# EasyEDA schematic SCH_Rover-Scheme1_2026-06-01.json
TITLE: Sheet_1; REV: 1.0; Date: 2026-05-30; Sheet: 1/1; Drawn By: jimmysiska6; Company: Your Company
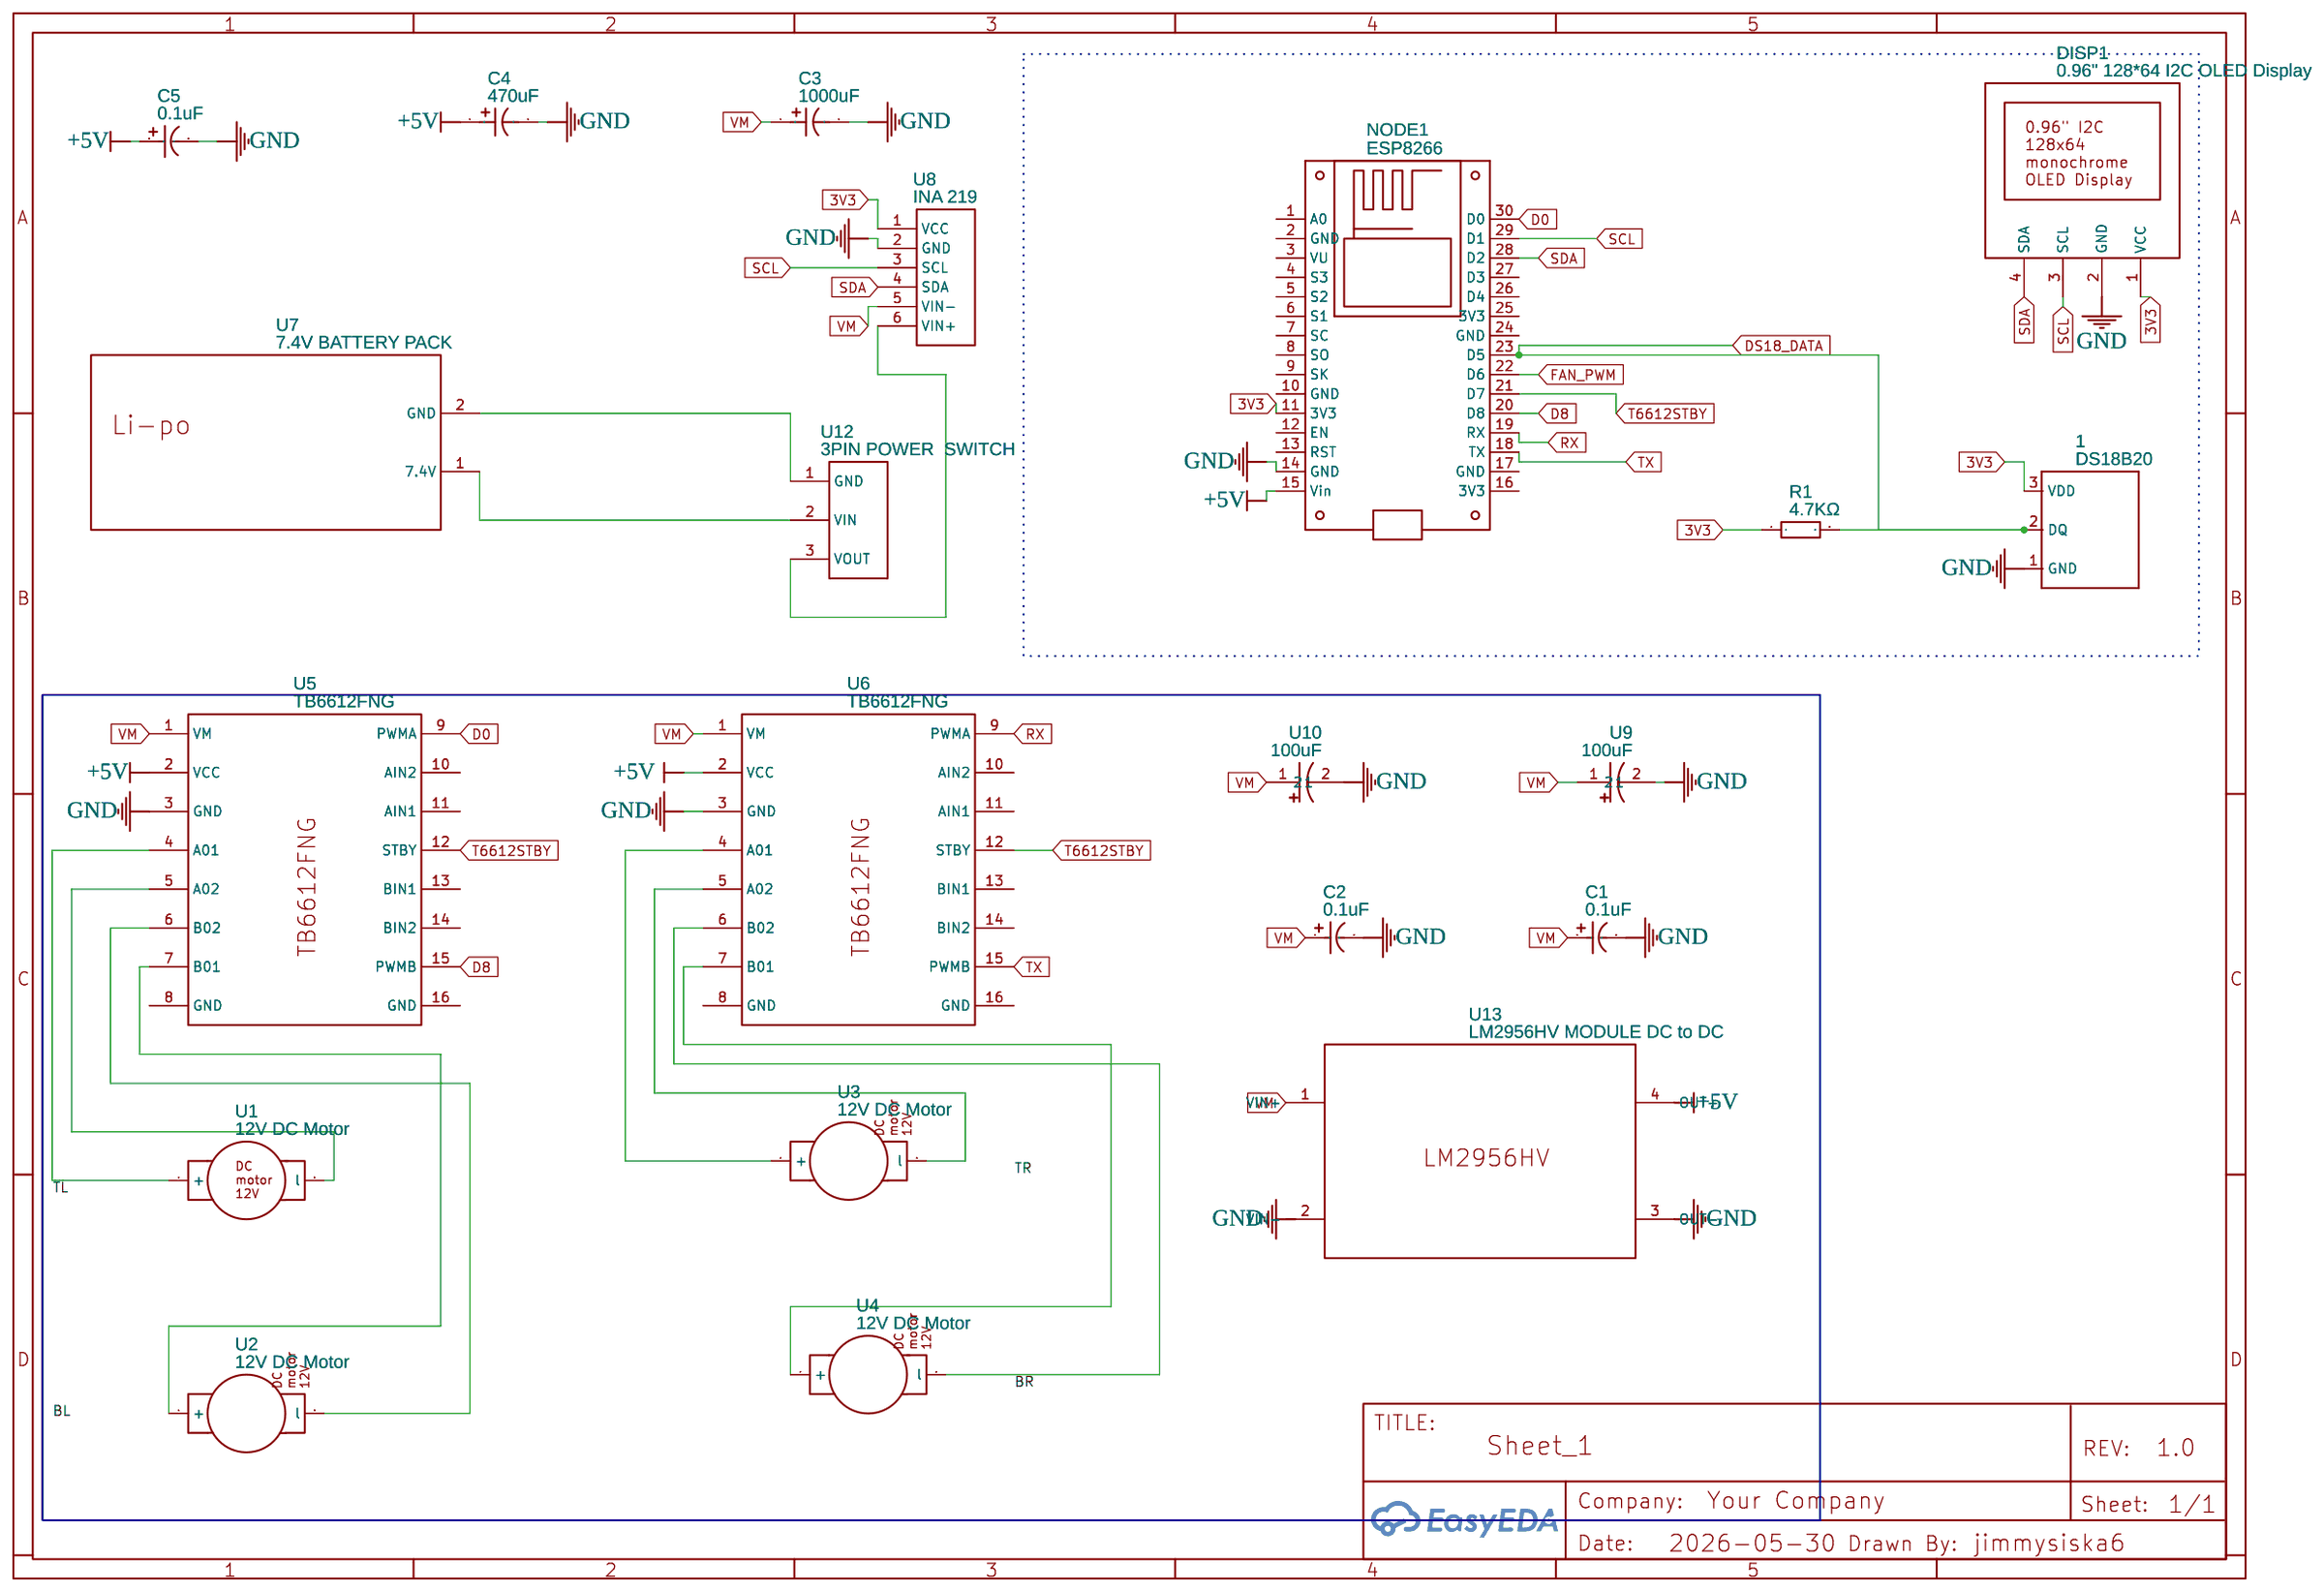
[diagram p0: schematic sheet]

## Parts
1  DS18B20  [DS18B20]
C1  0.1uF  [ELECTROLYTIC CAPACITOR TH]
C2  0.1uF  [ELECTROLYTIC CAPACITOR TH]
C3  1000uF  [CAP-TH_BD8.0-P3.50-D0.5_1000UF10V8X14GF]
C4  470uF  [CAP-TH_BD8.0-P3.50-D0.5-FD]
C5  0.1uF  [ELECTROLYTIC CAPACITOR TH]
DISP1  0.96" 128*64 I2C OLED Display  [OLED12864_096I2C]
NODE1  ESP8266  [COMM-TH_NODEMCU-32SLUA]
R1  4.7KΩ  [0402]
U1  12V DC Motor  [MOTOR12V]
U2  12V DC Motor  [MOTOR12V]
U3  12V DC Motor  [MOTOR12V]
U4  12V DC Motor  [MOTOR12V]
U5  TB6612FNG  [TB6612FNG]
U6  TB6612FNG  [TB6612FNG]
U7  7.4V BATTERY PACK  [7.4V BATTERY]
U8  INA 219  [INA219]
U9  100uF  [100UF-D5XL11MM-HORN-TYPE-POLAR-ELECTROLYTIC-CAPACITORS-FP]
U10  100uF  [100UF-D5XL11MM-HORN-TYPE-POLAR-ELECTROLYTIC-CAPACITORS-FP]
U12  3PIN POWER  SWITCH  [3PIN POWER SWITCH]
U13  LM2956HV MODULE DC to DC  [LM2956 MODULE]

## Library data of the parts
1 = DS18B20: Contributor: hjawan514
C1 C2 C5 = 0.1uF: Voltage: 50V; Mounted: Yes; Contributor: elimentic
C3 = 1000UF10V8X14GF: Supplier: LCSC; Supplier Part: C49332862; Manufacturer: Econd(米朗电子); Manufacturer Part: 1000uF10V8x14GF; JLCPCB Part Class: Extended Part; Contributor: lcsc
C4 = 16V470UF CD288: Contributor: LCSC; Supplier: LCSC; Supplier Part: C2960229; Manufacturer: HRK(鸿瑞凯电子); Manufacturer Part: 16V470uF CD288; JLCPCB Part Class: Extended Part
DISP1 = 0.96" 128*64 I2C OLED Display: Contributor: fohengineer; sourceId: hdI0icuoG
NODE1 = NODE MCU V3 ESP8266: Contributor: siamprimecomputer; Supplier Part: B0CNYJS6V7; Supplier: Amazon; Manufacturer Part: ‎3-01-1841; Manufacturer: HiLetgo; link: https://www.amazon.com/HiLetgo-Interface-Internet-Wireless-Development/dp/B0CNYJS6V7
R1 = 4.7KΩ: Power: 1/16W; Tolerance: ±1%; Supplier Part: 603-RC0402FR-074K7L; Supplier: Mouser; Manufacturer: Yageo; Manufacturer Part: RC0402FR-074K7L; LCSC: C25879; LCSC Assembly: Yes
U1-U4 = 12V DC Motor: Contributor: JoviBoy; sourceId: dYWQKEa7R
U5 U6 = TB6612FNG: Contributor: Marco Torres
U7 = 7.2V BATTERY PACK: Contributor: carlosvidal
U8 = INA 219: Contributor: www.vselo.pisem.su
U9 U10 = 100UF-D5XL11MM-HORN-TYPE-POLAR-ELECTROLYTIC-CAPACITORS COPY: Contributor: aades2204; Supplier: LCSC; Supplier Part: C1592120; Manufacturer: rubycon(红宝石); Manufacturer Part: 6.3NA100MEFC5X11
U12 = 3PIN POWER  SWITCH: Contributor: KirillBogatikov
U13 = LM2956HV MODULE DC to DC: Contributor: mtilove1101

## Nets
3V3: 1.3(VDD) DISP1.1(VCC) NODE1.11(3V3) R1.1 U8.1(VCC)
+5V: C4.1 C5.1 NODE1.15(Vin) U5.2(VCC) U6.2(VCC)
GND: 1.1(GND) C1.2 C2.2 C3.2 C4.2 C5.2 DISP1.2(GND) NODE1.14(GND) U5.3(GND) U6.3(GND) U8.2(GND) U9.2 U10.2
D0: NODE1.30(D0) U5.9(PWMA)
D8: NODE1.20(D8) U5.15(PWMB)
DS18_DATA: 1.2(DQ) NODE1.23(D5) R1.2
FAN_PWM: NODE1.22(D6)
RX: NODE1.19(RX) U6.9(PWMA)
SCL: DISP1.3(SCL) NODE1.29(D1) U8.3(SCL)
SDA: DISP1.4(SDA) NODE1.28(D2) U8.4(SDA)
T6612STBY: NODE1.21(D7) U5.12(STBY) U6.12(STBY)
TX: NODE1.18(TX) U6.15(PWMB)
VM: C1.1 C2.1 C3.1 U5.1(VM) U6.1(VM) U8.5(VIN-) U9.1 U10.1
Net-(U1-1): U1.1(+) U5.4(A01)
Net-(U1-2): U1.2(l) U5.5(A02)
Net-(U2-1): U2.1(+) U5.7(B01)
Net-(U2-2): U2.2(l) U5.6(B02)
Net-(U3-1): U3.1(+) U6.4(A01)
Net-(U3-2): U3.2(l) U6.5(A02)
Net-(U4-1): U4.1(+) U6.7(B01)
Net-(U4-2): U4.2(l) U6.6(B02)
Net-(U7-1): U7.1(7.4V) U12.2(VIN)
Net-(U7-2): U7.2(GND) U12.1(GND)
Net-(U8-6): U8.6(VIN+) U12.3(VOUT)

Not connected (* = marked no-connect by the designer): NODE1 1(A0) 2(GND) 3(VU) 4(S3) 5(S2) 6(S1) 7(SC) 8(SO) 9(SK) 10(GND) 12(EN) 13(RST) 16(3V3) 17(GND) 24(GND) 25(3V3) 26(D4) 27(D3); U5 8(GND) 10(AIN2) 11(AIN1) 13(BIN1) 14(BIN2) 16(GND); U6 8(GND) 10(AIN2) 11(AIN1) 13(BIN1) 14(BIN2) 16(GND); U13 1(VIN+) 2(VIN-) 3(OUT-) 4(OUT+)
